# EasyEDA Pro project 17mm荧光弹丸充能装置.eprj

# Schematic 恒流原理图
Create Date: 2023-11-01; Page Name: P1; Project Name: 17mm荧光弹丸充能装置; Schematic Name: 恒流原理图; Update Date: 2023-12-04; Company: ICBK破冰船实验室; Page Size: A4; Version: V1.0
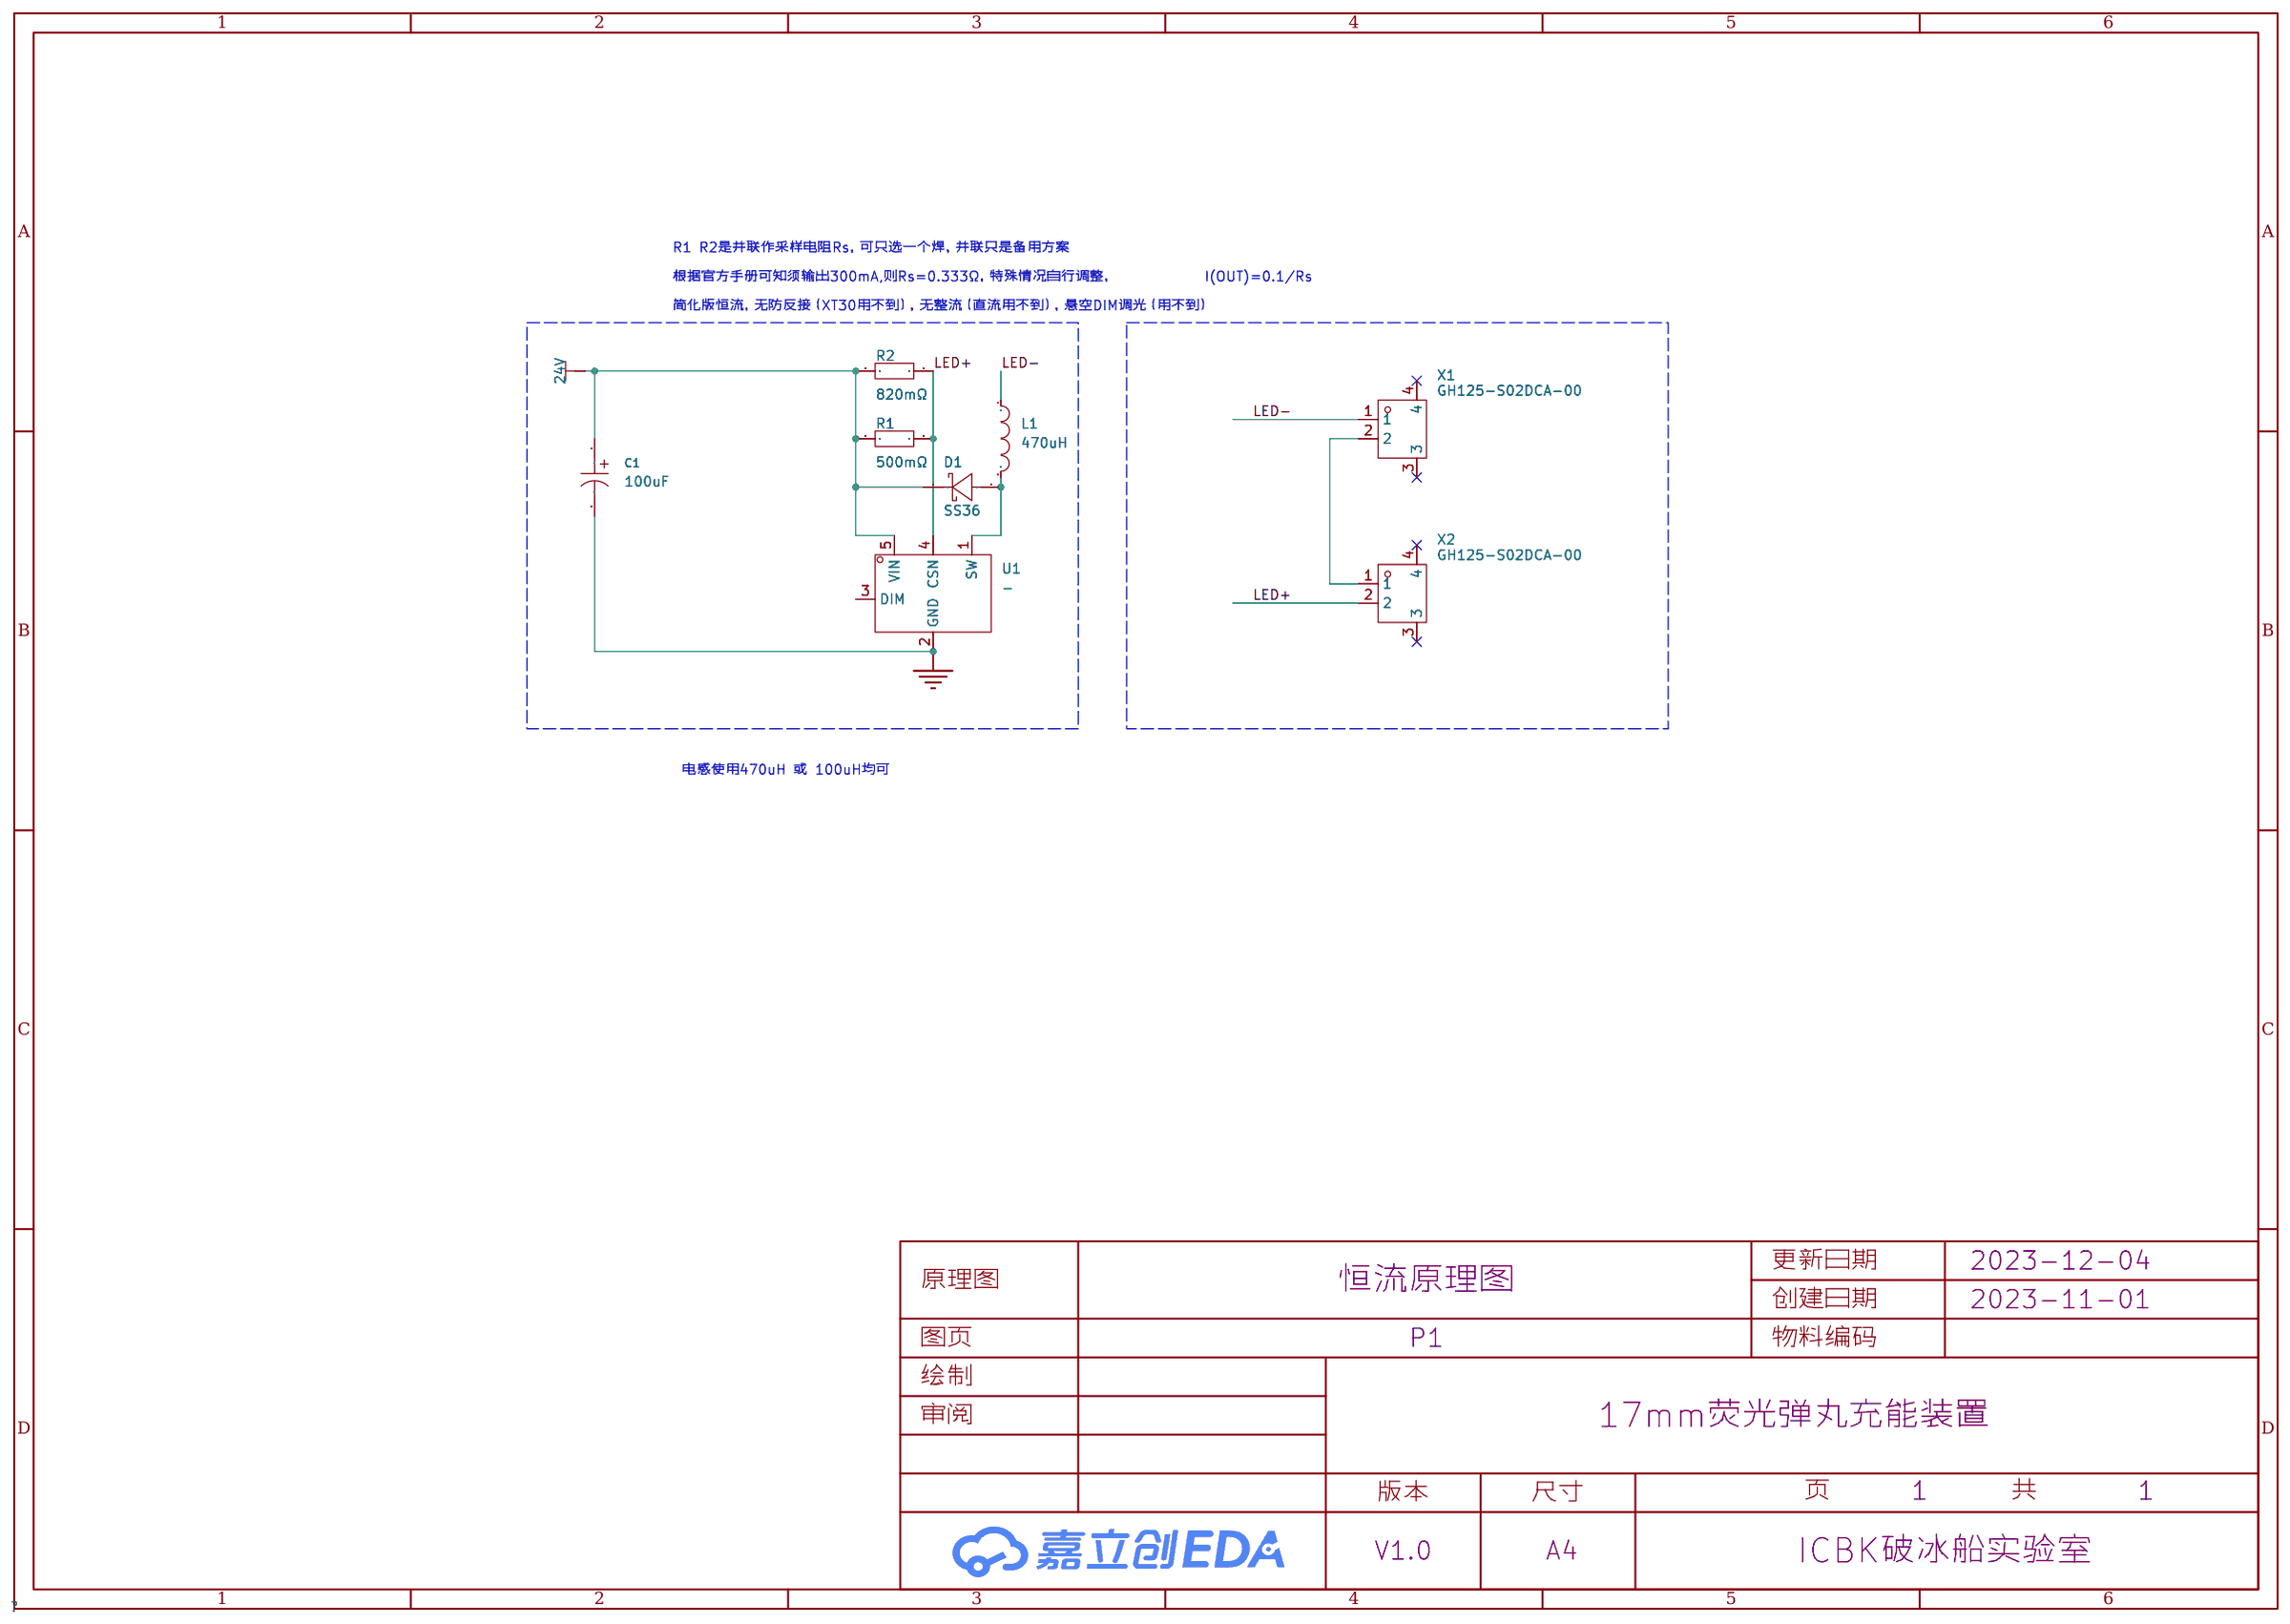
[diagram p0: schematic sheet]

## Parts
C1  100uF  [CAP-SMD_BD6.3-L6.6-W6.6-LS7.6-FD-1]
D1  SS36  [SMA_L4.4-W2.6-LS5.0-RD]
L1  470uH  [IND-SMD_L6.0-W6.0]
R1  500mΩ  [R1206]
R2  820mΩ  [R1206]
U1  -  [SOT-89-5_L4.5-W2.5-P1.50-LS4.5-BR]
X1  GH125-S02DCA-00  [CONN-SMD_2P-P1.25_JUSHUO_GH125-S02DCA-00]
X2  GH125-S02DCA-00  [CONN-SMD_2P-P1.25_JUSHUO_GH125-S02DCA-00]

## Library data of the parts
C1 = RVE100UF35V67RV0072: 容值:100uF;精度:±20%;额定电压:35V;纹波电流:230mA@120Hz;等效串联电阻:600mΩ@100kHz;; LCSC Part Name: 100uF ±20% 35V; Supplier Part: C2836437; Manufacturer: KNSCHA(科尼盛); Supplier Footprint: SMD,D6.3xL7.7mm; JLCPCB Part Class: Extended Part; Datasheet: https://atta.szlcsc.com/upload/public/pdf/source/20220719/B52EB46F8A1558448ED03D8B4CB3C24F.pdf; Supplier: LCSC; Tolerance: ±20%; Rated Voltage: 35V; φD: 6.3mm; L: 7.7mm; Ripple Current: 230mA@120Hz; Equivalent Series Resistance(ESR): 600mΩ@100kHz; Lifetime @ Temp: 2000hrs@105℃; Operating Temperature: -55℃~+105℃
D1 = SS36_C727061: 二极管配置:独立式;直流反向耐压(Vr):60V;平均整流电流(Io):3A;正向压降(Vf):700mV@3A;; LCSC Part Name: 电压:60V 电流:3A; Supplier Part: C727061; Manufacturer: TWGMC(台湾迪嘉); Supplier Footprint: SMA(DO-214AC); JLCPCB Part Class: Extended Part; Datasheet: https://atta.szlcsc.com/upload/public/pdf/source/20200828/C727059_6599B6CAC5F3238B9C33E46794659DBE.pdf; Supplier: LCSC; Diode Configuration: 独立式; Reverse Voltage (Vr): 60V; Average Rectified Current (Io): 3A; Forward Voltage (Vf@If): 700mV@3A; Reverse Leakage Current (Ir): 500uA@60V
L1 = YNR6045-470M: 电感值:47uH;精度:±20%;额定电流:1.2A;; LCSC Part Name: 47uH ±20% 1.2A 200mΩ; Supplier Part: C497841; Manufacturer: YJYCOIN(益嘉源); Supplier Footprint: SMD,6x6mm; JLCPCB Part Class: 扩展库; Datasheet: https://atta.szlcsc.com/upload/public/pdf/source/20200317/C497838_ADAADDA66AFC043F2D8B9A62FB946728.pdf; Supplier: LCSC; Tolerance: ±20%; Rated Current: 1.2A; DC Resistance (DCR): 200mΩ
R1 R2 = 1206W4F500LT5E: 电阻类型:厚膜电阻;阻值:500mΩ;精度:±1%;功率:250mW;温度系数:±800ppm/℃;; LCSC Part Name: 厚膜电阻 500mΩ ±1% 250mW; Supplier Part: C25340; Manufacturer: UNI-ROYAL(厚声); Supplier Footprint: 1206; JLCPCB Part Class: Extended Part; Datasheet: https://atta.szlcsc.com/upload/public/pdf/source/20200306/C422600_1E6D84923E4A46A82E41ADD87F860B5C.pdf; Supplier: LCSC; Type: 厚膜电阻; Tolerance: ±1%; Power(Watts): 250mW; Temperature Coefficient: ±800ppm/℃; Overload Voltage (Max): 200V; Operating Temperature Range: -55℃~+155℃
U1 = PT4115_C347356: 类型:-;拓扑结构:-;内部开关:-;供电电压（最低）:-;供电电压（最高）:-;频率:-;; LCSC Part Name: PT4115; Supplier Part: C347356; Manufacturer: UMW(广东友台半导体); Manufacturer Part: PT4115; Supplier Footprint: SOT89-5; JLCPCB Part Class: 扩展库; Datasheet: https://atta.szlcsc.com/upload/public/pdf/source/20181213/C347356_53B4879F3B07AA7232DB5B3B76FA68B1.pdf; Supplier: LCSC
X1 X2 = GH125-S02DCA-00: 参考系列:-;间距:1.25mm;插针结构:1x2P;排数:1;每排PIN数:2;行距:-;公母:公型插针;安装方式:卧贴;额定电流:1A;工作温度范围:-25℃~+85℃;; LCSC Part Name: GH1.25卧式贴片 带扣; Supplier Part: C2886765; Manufacturer: JS(钜硕电子); Supplier Footprint: SMD,P=1.25mm; JLCPCB Part Class: 扩展库; Datasheet: https://atta.szlcsc.com/upload/public/pdf/source/20210818/CD11791E5ED3EDF45A7009E9C8A2BD4C.pdf; Supplier: LCSC; Pitch: 1.25mm; Pins Structure: 1x2P; Number of Rows: 1; Number of PINs Per Row: 2; Gender: 公型插针; Mounting Style: 卧贴; Current Rating (Max): 1A; Operating Temperature Range: -25℃~+85℃

## Nets
24V: C1.1 D1.1(K) R1.1 R2.1 U1.5(VIN)
GND: C1.2 U1.2(GND)
LED+: R1.2 R2.2 U1.4(CSN) X2.2
LED-: L1.1 X1.1
$1N398: X1.2 X2.1
$1N2069: D1.2(A) L1.2 U1.1(SW)

Not connected (* = marked no-connect by the designer): U1 3(DIM); X1 3* 4*; X2 3* 4*

## Notes on the sheet
- R1 R2是并联作采样电阻Rs，可只选一个焊，并联只是备用方案
- 根据官方手册可知须输出300mA,则Rs=0.333Ω，特殊情况自行调整，
- I(OUT)=0.1/Rs
- 简化版恒流，无防反接（XT30用不到），无整流（直流用不到），悬空DIM调光（用不到）
- 电感使用470uH 或 100uH均可

# Schematic 灯板原理图
Create Date: 2023-12-04; Page Name: P1; Project Name: 17mm荧光弹丸充能装置; Schematic Name: 灯板原理图; Update Date: 2023-12-04; Company: ICBK破冰船实验室; Page Size: A4; Version: V1.0
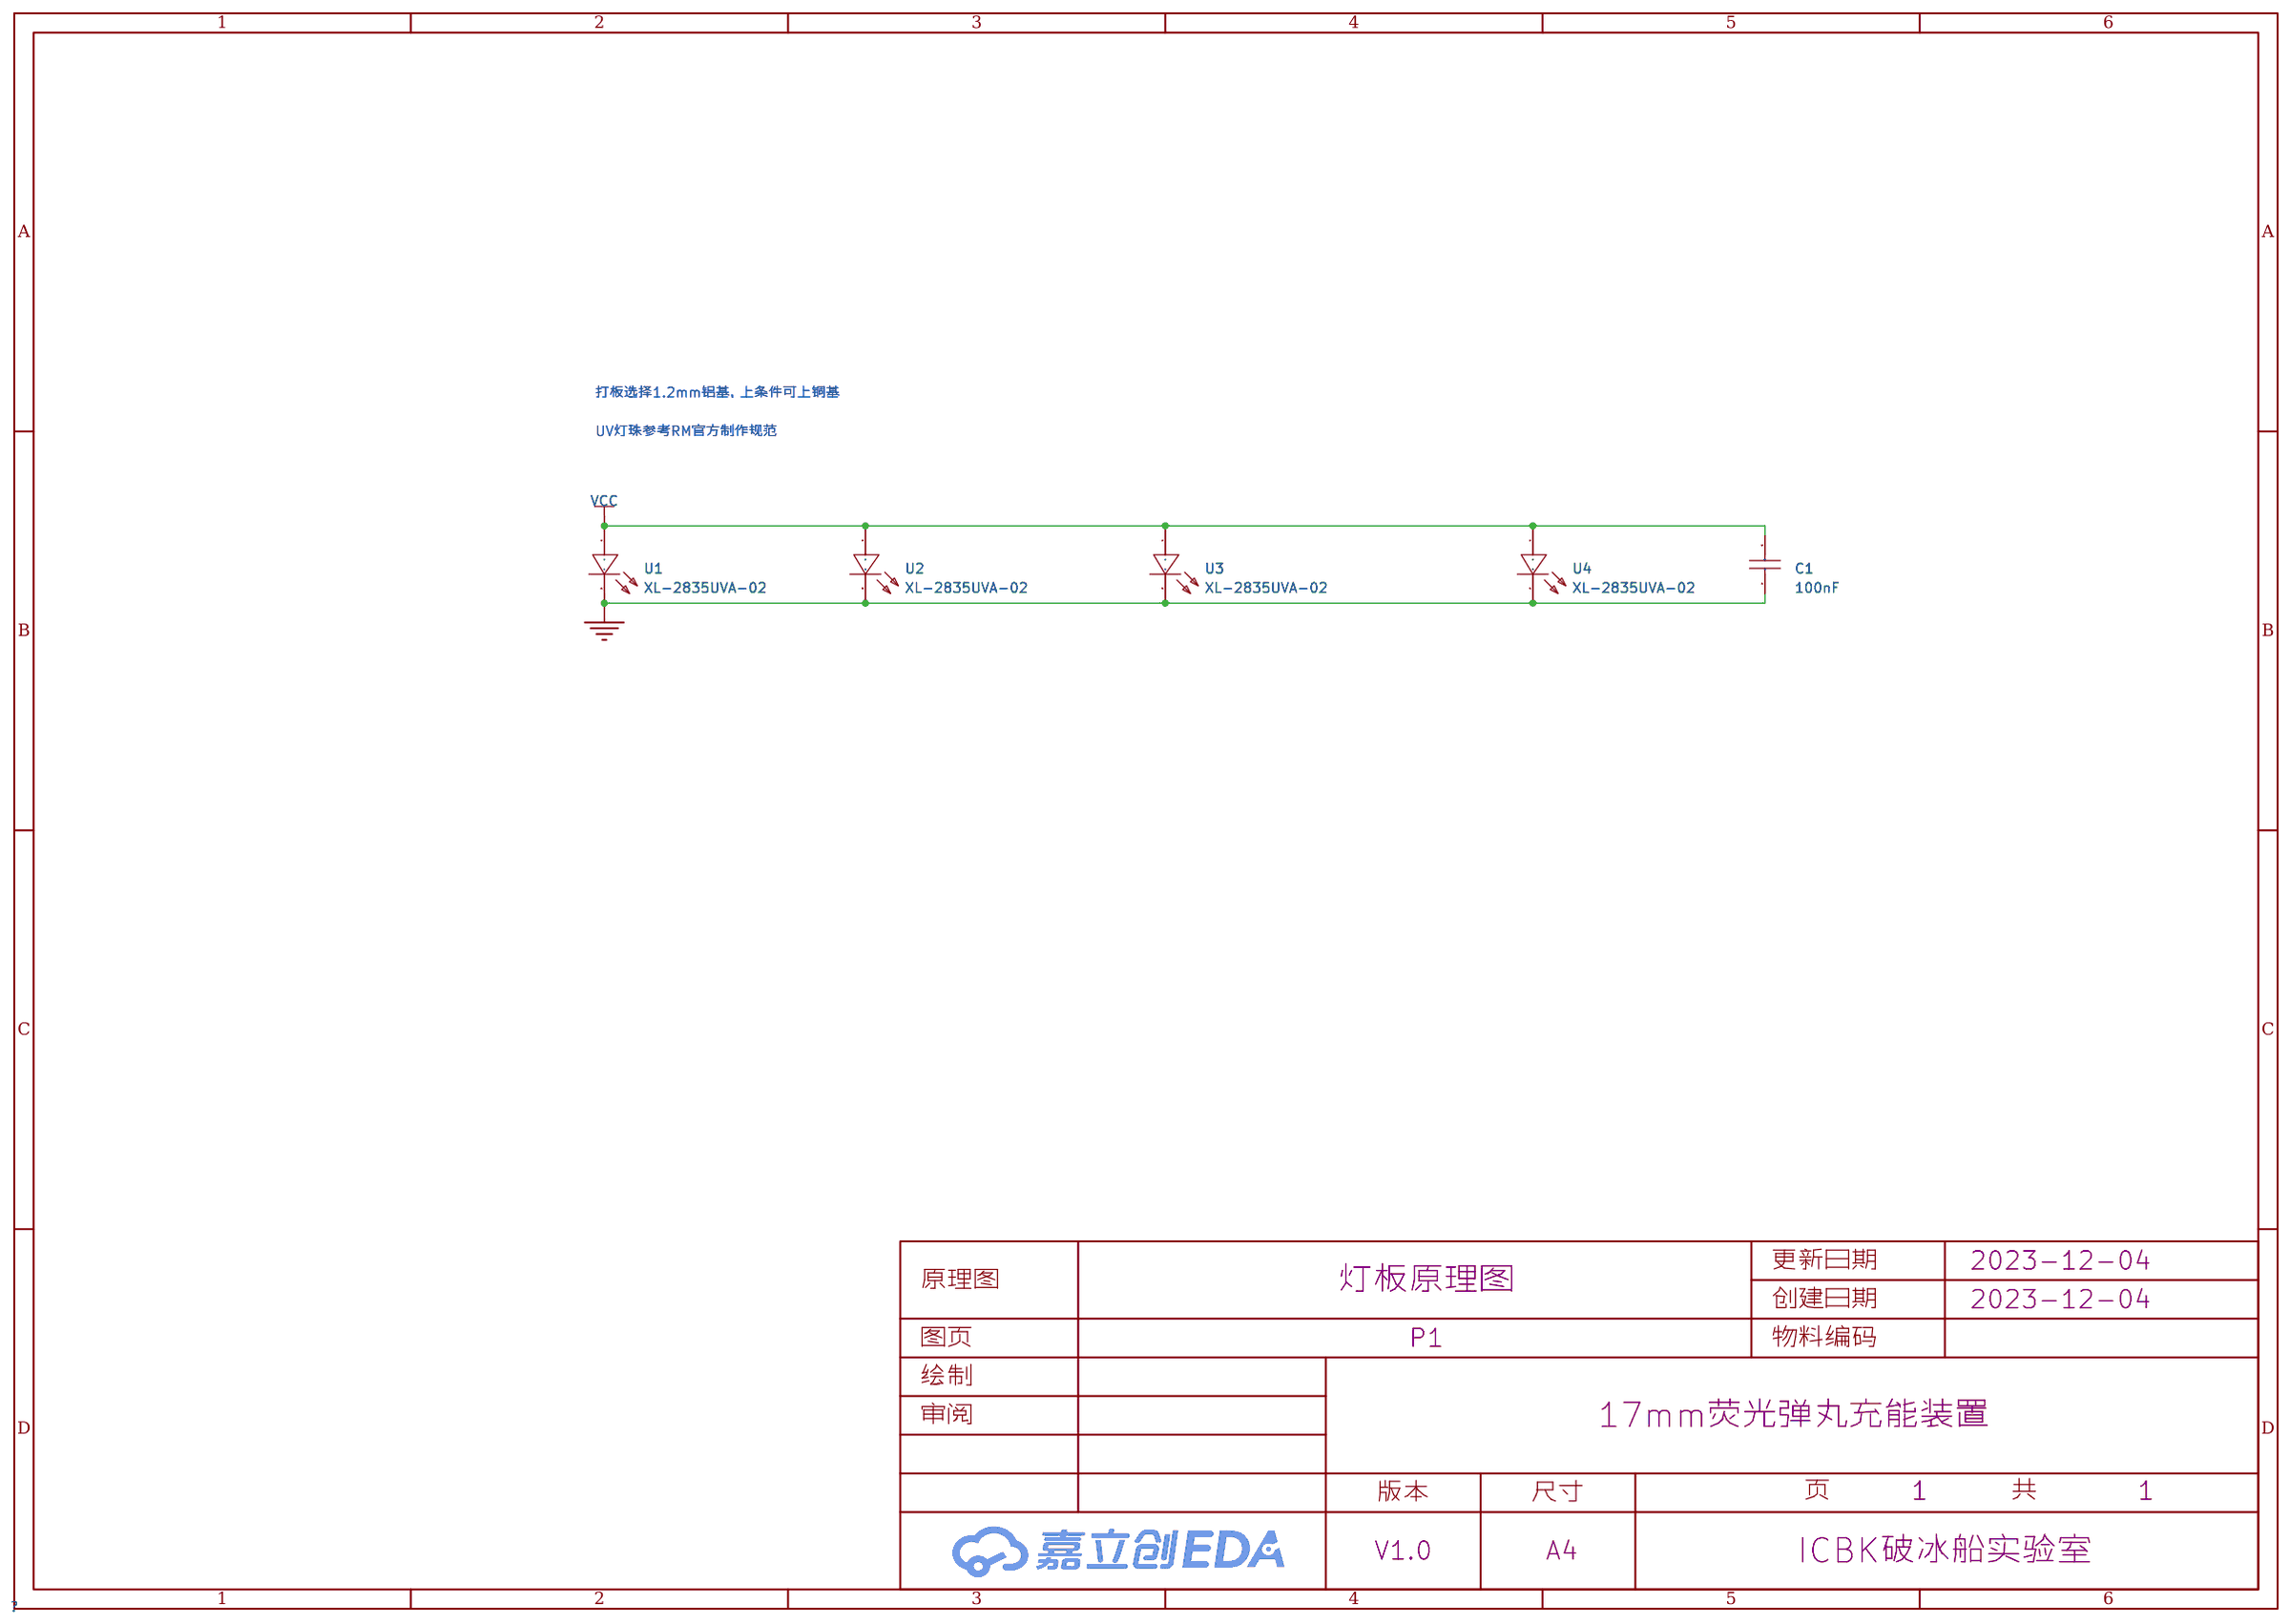
[diagram p1: schematic sheet]

## Parts
C1  100nF  [C0603]
U1  XL-2835UVA-02  [LED-SMD_L3.5-W2.8-FD_WHITE-1]
U2  XL-2835UVA-02  [LED-SMD_L3.5-W2.8-FD_WHITE-1]
U3  XL-2835UVA-02  [LED-SMD_L3.5-W2.8-FD_WHITE-1]
U4  XL-2835UVA-02  [LED-SMD_L3.5-W2.8-FD_WHITE-1]

## Library data of the parts
C1 = 0603B104K500NT: 容值:100nF;精度:±10%;额定电压:50V;材质(温度系数):X7R;; LCSC Part Name: 100nF ±10% 50V; Supplier Part: C30926; Manufacturer: FH(风华); Supplier Footprint: 0603; JLCPCB Part Class: 扩展库; Datasheet: https://atta.szlcsc.com/upload/public/pdf/source/20170923/C30926_1506149436298988724.pdf; Supplier: LCSC; Tolerance: ±10%; Voltage Rated: 50V; Temperature Coefficient: X7R
U1-U4 = XL-2835UVA-02: 峰值波长:395nm~400nm;正向电压:3V~3.4V;正向电流:60mA;辐射功率:-;; LCSC Part Name: 2835紫外LED 120度; Supplier Part: C2843877; Manufacturer: XINGLIGHT(成兴光); Supplier Footprint: SMD2835; JLCPCB Part Class: 扩展库; Datasheet: https://atta.szlcsc.com/upload/public/pdf/source/20221222/588CE70D5A7BFFA5DAC036FA694F6081.pdf; Supplier: LCSC; Peak Wavelength: 395nm~400nm; Forward Voltage: 3V~3.4V; Forward Current: 60mA; Power Dissipation: 60mW; Viewing Angle: 120°; Operating Temperature: -40℃~80℃

## Nets
GND: C1.1 U1.2(K) U2.2(K) U3.2(K) U4.2(K)
VCC: C1.2 U1.1(A) U2.1(A) U3.1(A) U4.1(A)

## Notes on the sheet
- 打板选择1.2mm铝基，上条件可上铜基
- UV灯珠参考RM官方制作规范

# Board PCB2
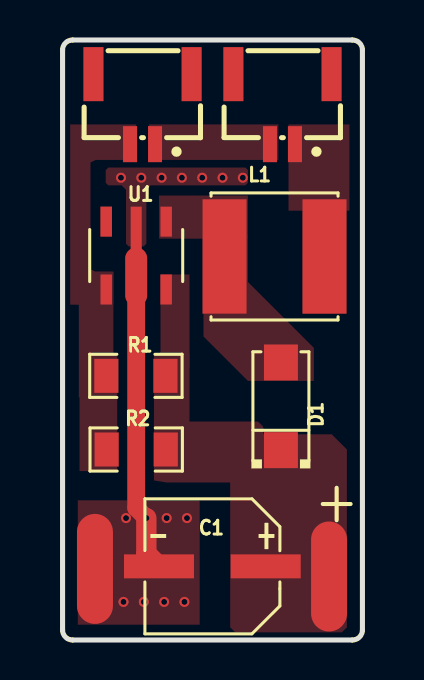
[diagram p2: board, top side]
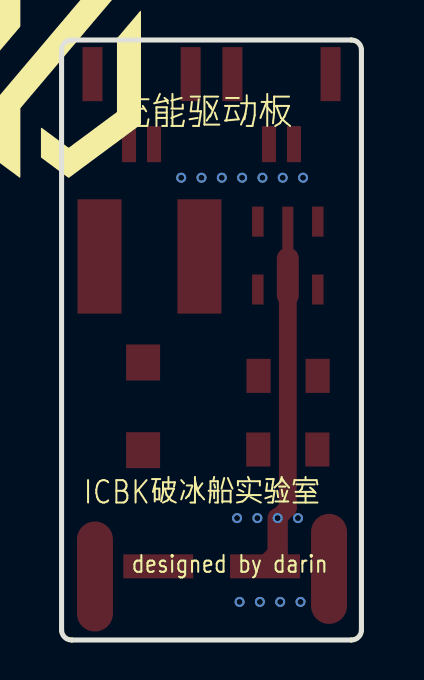
[diagram p3: board, bottom side, seen from below]

Outline 15 x 30 mm; copper layers: Top Layer, Bottom Layer. Coordinates in mm from the lower left corner of the outline.
Outline path: 0,29.5 0,0.5 arc(0.15,0.15) 0.5,0 14.5,0 arc(14.85,0.15) 15,0.5 15,29.5 arc(14.85,29.85) 14.5,30 0.5,30 arc(0.15,29.85) 0,29.5
Stack: Top Layer 0.035mm / Dielectric1 1.51mm FR4 er 4.5 / Bottom Layer 0.035mm

## Design rules (mm)
template: 自定义配置
spacing copperThickness1oz (default): track to track 0.102, other pairs 0.152 to 0.3
spacing copperThickness2oz: track to track 0.203, other pairs 0.152 to 0.3
track width copperThickness1oz (default): min 0.127, default 0.254, max 2.54
track width copperThickness2oz: min 0.203, default 0.254, max 2.54
differential pair differentialPair (default): width min 0.127, default 0.254, max 2.54; gap min 0.152, default 0.152
via viaSize (default): diameter min 0.5, default 0.61, max 10; hole min 0.3, default 0.305, max 6.3

## Placement (name value [footprint] x y rotation side)
C1  100uF  [CAP-SMD_BD6.3-L6.6-W6.6-LS7.6-FD-1]  7.49 3.68 180 top
D1  SS36  [SMA_L4.4-W2.6-LS5.0-RD]  10.92 11.68 90 top
L1  470uH  [IND-SMD_L6.0-W6.0]  10.6 19.18 180 top
NOREF  -  [Pad_e46]  13.33 3.17 0 top
NOREF#2  -  [Pad_e43]  1.62 3.56 0 top
R1  500mΩ  [R1206]  3.67 13.21 180 top
R2  820mΩ  [R1206]  3.68 9.53 180 top
U1  -  [SOT-89-5_L4.5-W2.5-P1.50-LS4.5-BR]  3.68 19.22 90 top
X1  GH125-S02DCA-00  [CONN-SMD_2P-P1.25_JUSHUO_GH125-S02DCA-00]  11 26.54 180 top
X2  GH125-S02DCA-00  [CONN-SMD_2P-P1.25_JUSHUO_GH125-S02DCA-00]  4 26.54 180 top

## Footprints (pads in the part's own frame, mm; a bottom-side part is the same pattern mirrored in y, then rotated)
CAP-SMD_BD6.3-L6.6-W6.6-LS7.6-FD-1
  rect 3.5x1.2 smd: 1(-2.67,0) 2(2.67,0)
CONN-SMD_2P-P1.25_JUSHUO_GH125-S02DCA-00
  rect 0.7x1.8 smd: 1(-0.625,1.75) 2(0.625,1.75)
  rect 1x2.7 smd: 3(2.455,-1.75) 4(-2.455,-1.75)
IND-SMD_L6.0-W6.0
  rect 2.2x5.72 smd: 1(-2.5,0) 2(2.5,0)
Pad_e43
  oval 1.8x5.5 smd: 6(0,0)
Pad_e46
  oval 1.8x5.5 smd: 6(0,0)
R1206
  rect 1.208x1.701 smd: 1(-1.479,0) 2(1.479,0)
SMA_L4.4-W2.6-LS5.0-RD
  rect 1.8x1.7 smd: 1(-2.192,0) 2(2.192,0)
SOT-89-5_L4.5-W2.5-P1.50-LS4.5-BR
  rect 1.5x0.574 smd: 1(1.698,-1.5) 3(1.698,1.5) 4(-1.698,1.5) 5(-1.698,-1.5)
  oval 2.94x1.1 smd: 2(-1.067,0)
  rect 2.209x0.552 smd: 2(1.343,0)

## Nets
24V: C1.1 D1.1 NOREF.6 R1.1 R2.1 U1.5
GND: C1.2 NOREF#2.6 U1.2
LED+: R1.2 R2.2 U1.4 X2.2
LED-: L1.1 X1.1
$1N398: X1.2 X2.1
$1N2069: D1.2 L1.2 U1.1

Pads without a net: U1 3; X1 3 4; X2 3 4

## Via types
v1: diameter 0.5, hole 0.3, Top Layer to Bottom Layer, 15 vias

## Routing (per net, layer and track width the routed paths; a pad name or vN(x,y) marks a point on that pad's centre or on a via; arc(x,y) is an arc through that point)
GND: length 14.9
  Top Layer w0.889: v1(4.19,6.1) 3.68,6.6 U1.2
  Top Layer w1.016: v1(4.19,6.1) 4.19,4.31 C1.2
  vias: v1(2.92,23.11) v1(3.05,1.91) v1(3.18,6.1) v1(3.94,23.11) v1(4.06,1.91) v1(4.95,23.11) v1(5.08,1.91) v1(5.21,6.1) v1(5.97,23.11) v1(6.1,1.91) v1(6.22,6.1) v1(6.99,23.11) v1(8,23.11) v1(9.02,23.11)

## Copper pours and planes (outline as drawn; the poured copper is in the pictures)
24V on Top Layer: 8.38,10.29 14.22,10.29 14.22,0.38 8.38,0.38
24V on Top Layer: 4.57,10.92 10.03,10.92 10.03,7.87 4.57,7.87
24V on Top Layer: 4.9,18.27 6.35,18.27 6.35,13.6 4.9,13.6
24V on Top Layer: 4.57,14.35 6.35,14.35 6.35,8.13 4.57,8.13
GND on Top Layer: 0.76,6.98 6.86,6.98 6.86,0.76 0.76,0.76
GND on Top Layer: 2.16,23.62 9.27,23.62 9.27,19.69 2.16,19.69
GND on Bottom Layer: -2.67,31.5 17.02,31.5 17.02,-1.52 -2.67,-1.52
LED+ on Top Layer: 0.81,18.42 2.72,18.42 2.72,12.13 0.81,12.13
LED+ on Top Layer: 0.38,25.78 3.68,25.78 3.68,16.76 0.38,16.76
LED+ on Top Layer: 0.85,14.29 2.73,14.29 2.73,8.45 0.85,8.45
LED- on Top Layer: 11.3,25.78 14.35,25.78 14.35,21.46 11.3,21.46
$1N398 on Top Layer: 4.32,25.78 10.79,25.78 10.79,24 4.32,24
$1N2069 on Top Layer: 7.05,20.25 12.57,20.25 12.57,12.95 7.05,12.95
$1N2069 on Top Layer: 4.83,22.22 9.27,22.22 9.27,20.07 4.83,20.07

## Text on the board
Bottom Silkscreen Layer: designed by darin | ICBK破冰船实验室 | 充能驱动板
Top Silkscreen Layer: +

# Board PCB1
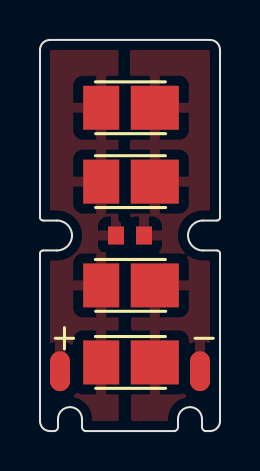
[diagram p4: board, top side]
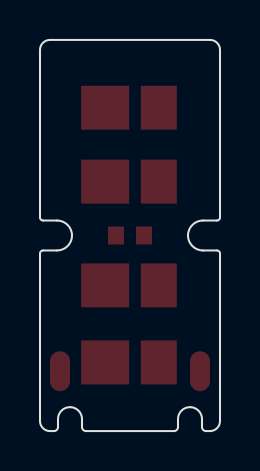
[diagram p5: board, bottom side, seen from below]

Outline 9 x 19.6 mm; copper layers: Top Layer, Bottom Layer. Coordinates in mm from the lower left corner of the outline.
Outline path: 0,19.1 0,10.7 arc(0.04,10.59) 0.15,10.55 0.85,10.55 arc(1.6,9.8) 0.85,9.05 0.15,9.05 arc(0.04,9.01) 0,8.9 0,0.5 arc(0.15,0.15) 0.5,0 0.7,0 arc(0.84,0.06) 0.9,0.2 0.9,0.6 arc(1.08,1.02) 1.5,1.2 arc(1.92,1.02) 2.1,0.6 2.1,0.2 arc(2.16,0.06) 2.3,0 6.7,0 arc(6.84,0.06) 6.9,0.2 6.9,0.6 arc(7.08,1.02) 7.5,1.2 arc(7.92,1.02) 8.1,0.6 8.1,0.2 arc(8.16,0.06) 8.3,0 8.5,0 arc(8.85,0.15) 9,0.5 9,8.9 arc(8.96,9.01) 8.85,9.05 8.15,9.05 arc(7.4,9.8) 8.15,10.55 8.85,10.55 arc(8.96,10.59) 9,10.7 9,19.1 arc(8.85,19.45) 8.5,19.6 0.5,19.6 arc(0.15,19.45) 0,19.1
Stack: Top Layer 0.035mm / Dielectric1 1.51mm FR4 er 4.5 / Bottom Layer 0.035mm

## Design rules (mm)
template: 自定义配置
spacing copperThickness1oz (default): track to track 0.102, other pairs 0.152 to 0.3
spacing copperThickness2oz: track to track 0.203, other pairs 0.152 to 0.3
track width copperThickness1oz (default): min 0.127, default 0.254, max 2.54
track width copperThickness2oz: min 0.203, default 0.254, max 2.54
differential pair differentialPair (default): width min 0.127, default 0.254, max 2.54; gap min 0.152, default 0.152
via viaSize (default): diameter min 0.5, default 0.61, max 10; hole min 0.3, default 0.305, max 6.299

## Placement (name value [footprint] x y rotation side)
C1  100nF  [C0603]  4.5 9.8 180 top
NOREF  -  [Pad_e21]  1 3 0 top
NOREF#2  -  [Pad_e22]  8 3 0 top
U1  XL-2835UVA-02  [LED-SMD_L3.5-W2.8-FD_WHITE-1]  4.4 16.2 0 top
U2  XL-2835UVA-02  [LED-SMD_L3.5-W2.8-FD_WHITE-1]  4.4 12.5 0 top
U3  XL-2835UVA-02  [LED-SMD_L3.5-W2.8-FD_WHITE-1]  4.4 7.3 0 top
U4  XL-2835UVA-02  [LED-SMD_L3.5-W2.8-FD_WHITE-1]  4.4 3.44 0 top

## Footprints (pads in the part's own frame, mm; a bottom-side part is the same pattern mirrored in y, then rotated)
C0603
  rect 0.8x0.9 smd: 1(-0.7,0) 2(0.7,0)
LED-SMD_L3.5-W2.8-FD_WHITE-1
  rect 1.8x2.2 smd: 1(-1.34,0)
  rect 2.4x2.2 smd: 2(1.34,0)
Pad_e21
  oval 1x2 smd: 3(0,0)
Pad_e22
  oval 1x2 smd: 4(0,0)

## Nets
GND: C1.1 NOREF#2.4 U1.2 U2.2 U3.2 U4.2
VCC: C1.2 NOREF.3 U1.1 U2.1 U3.1 U4.1

## Copper pours and planes (outline as drawn; the poured copper is in the pictures)
GND on Top Layer: 4.5,19.6 4.5,10.49 4.83,10.16 4.83,8.68 4.55,8.4 4.55,0 9.02,0 9.02,19.56 8.97,19.6
VCC on Top Layer: 3.93,19.6 3.93,10.55 4.19,10.29 4.19,8.64 3.94,8.38 3.94,0 0,0 0,19.6

## Text on the board
Top Silkscreen Layer: + | -
